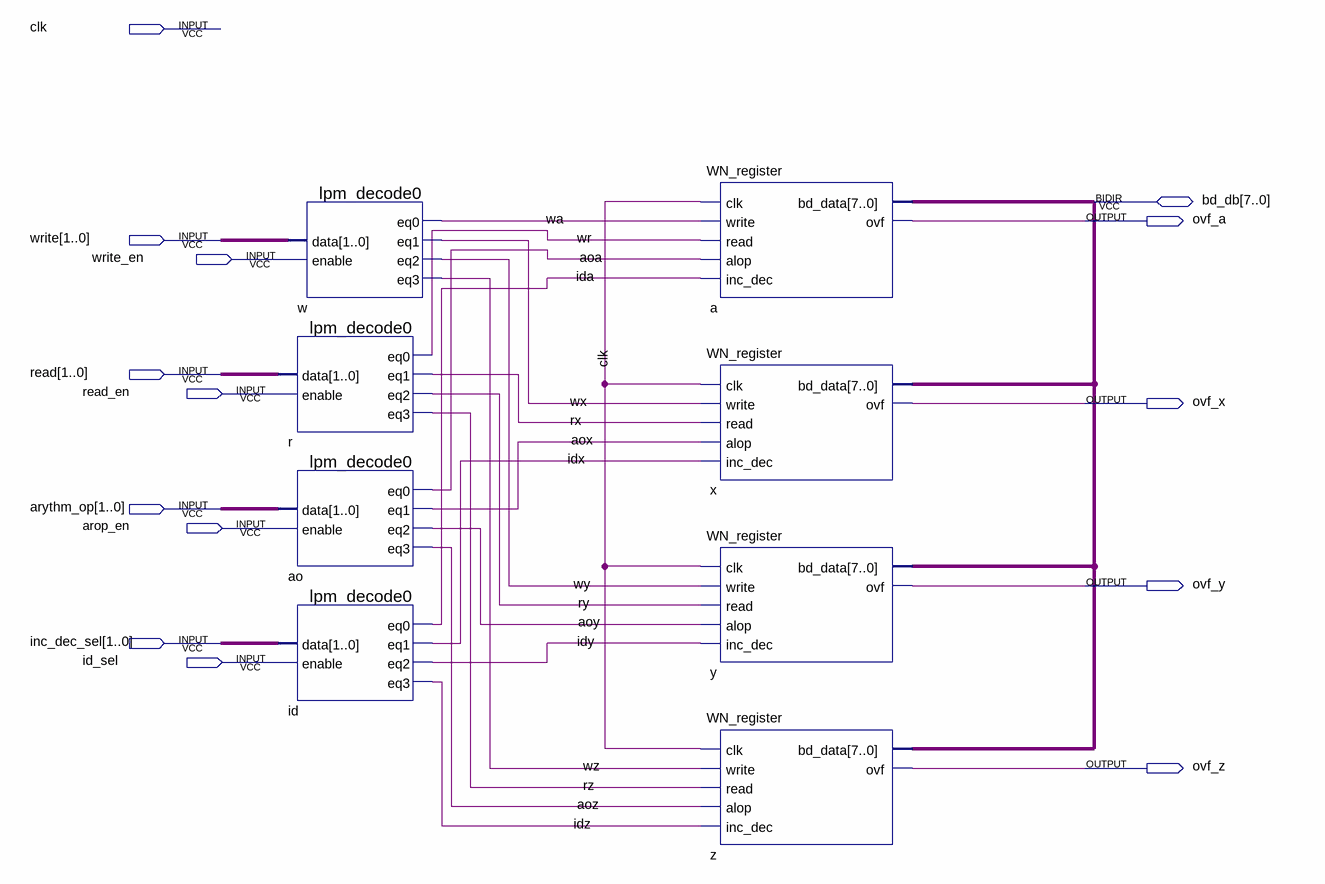
[diagram p0: schematic sheet]
// Quartus schematic WN_GPR_plain.bdf as structural Verilog: 8 symbols, 14 pins
module WN_GPR_plain (
  input  clk,
  input  [1:0] write,
  input  write_en,
  input  [1:0] read,
  input  read_en,
  input  [1:0] arythm_op,
  input  arop_en,
  input  [1:0] inc_dec_sel,
  input  id_sel,
  inout  [7:0] bd_db,
  output ovf_a,
  output ovf_x,
  output ovf_y,
  output ovf_z
);

  wire aoa, aox, aoy, aoz, ida, idx, idy, idz, rx, ry, rz, wa, wr, wx, wy, wz;

  lpm_decode0 w (.data(write), .enable(write_en), .eq0(wa), .eq1(wx), .eq2(wy), .eq3(wz));
  lpm_decode0 r (.data(read), .enable(read_en), .eq0(wr), .eq1(rx), .eq2(ry), .eq3(rz));
  lpm_decode0 ao (.data(arythm_op), .enable(arop_en), .eq0(aoa), .eq1(aox), .eq2(aoy), .eq3(aoz));
  lpm_decode0 id (.data(inc_dec_sel), .enable(id_sel), .eq0(ida), .eq1(idx), .eq2(idy), .eq3(idz));
  WN_register a (.clk(clk), .write(wa), .read(wr), .alop(aoa), .inc_dec(ida), .ovf(ovf_a), .bd_data(bd_db));
  WN_register x (.clk(clk), .write(wx), .read(rx), .alop(aox), .inc_dec(idx), .ovf(ovf_x), .bd_data(bd_db));
  WN_register y (.clk(clk), .write(wy), .read(ry), .alop(aoy), .inc_dec(idy), .ovf(ovf_y), .bd_data(bd_db));
  WN_register z (.clk(clk), .write(wz), .read(rz), .alop(aoz), .inc_dec(idz), .ovf(ovf_z), .bd_data(bd_db));
endmodule
